# Altium project 电机驱动.PrjPCB
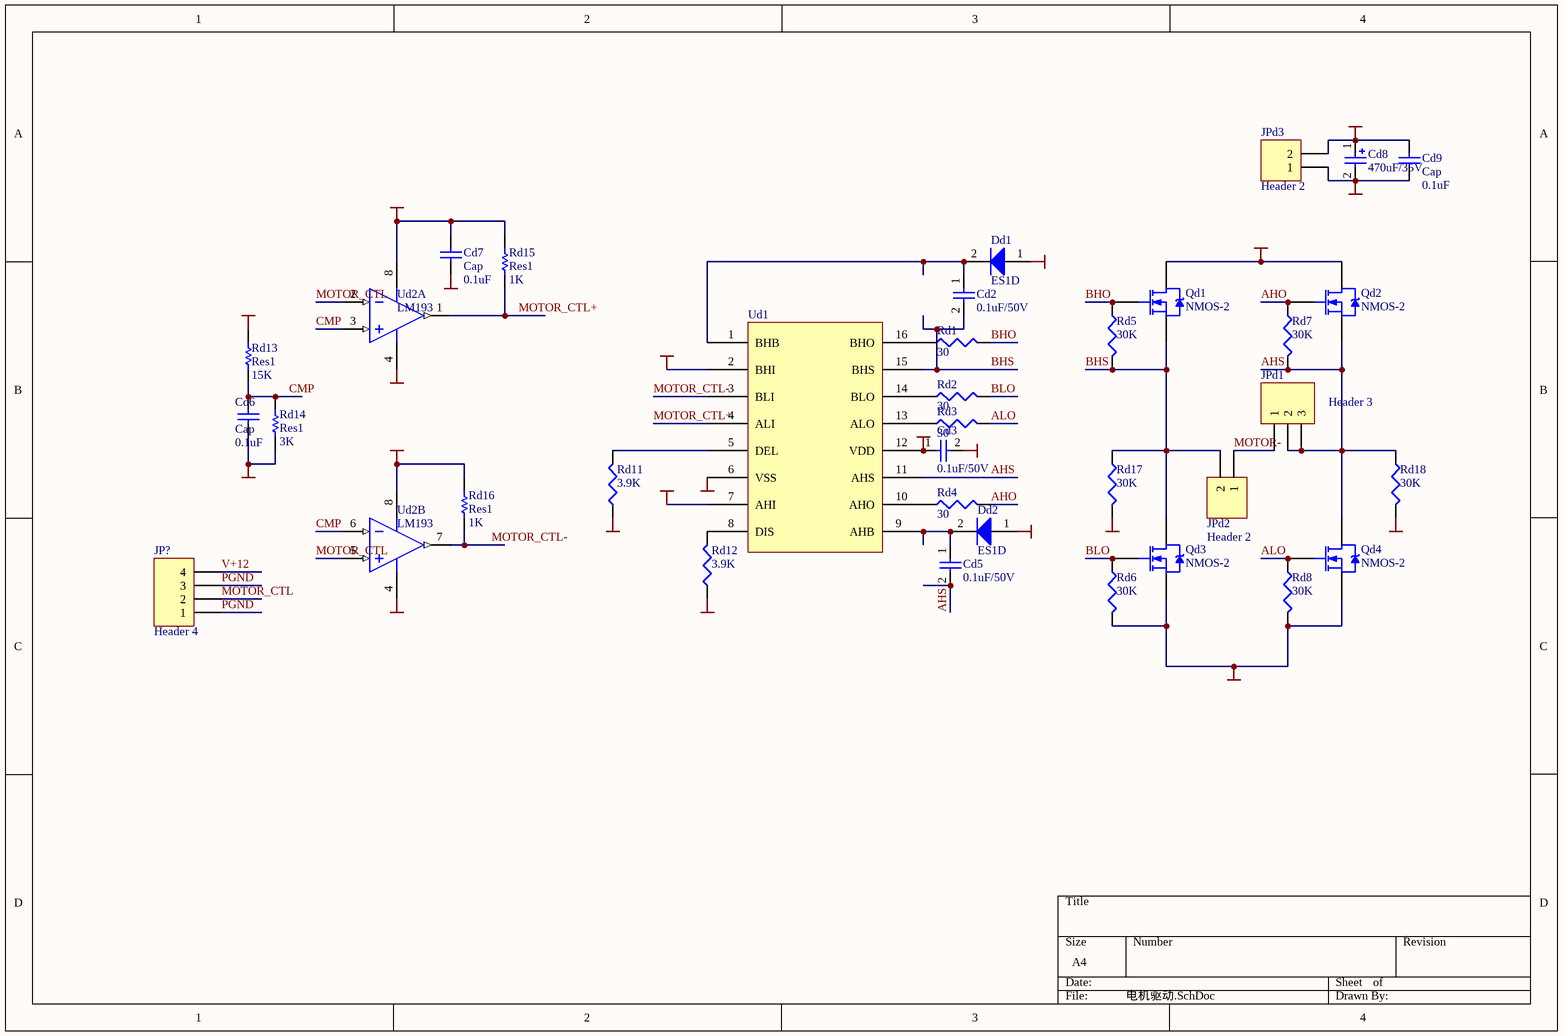
[diagram p0: 电机驱动.SchDoc]
1 sheet, 35 parts. Net scope: global (net labels, ports and power ports of the same name join across sheets).
Board file: 电机驱动.PcbDoc

## Sheet 电机驱动.SchDoc
size A4

### Parts
Cd2  value 0.1uF/50V  [CR2012-0805]  (hidden comment: Cap)
Cd3  value 0.1uF/50V  [CR2012-0805]  (hidden comment: Cap)
Cd5  value 0.1uF/50V  [CR2012-0805]  (hidden comment: Cap)
Cd6  Cap  value 0.1uF  [CR2012-0805]
Cd7  Cap  value 0.1uF  [CR2012-0805]
Cd8  value 470uF/35V  [C1000]  (hidden comment: Cap Pol1)
Cd9  Cap  value 0.1uF  [CR2012-0805]
Dd1  value ES1D  [DO-214-SMA-YX1]  (hidden comment: Diode_UFR)
Dd2  value ES1D  [DO-214-SMA-YX1]  (hidden comment: Diode_UFR)
JP1  Header 4  [HDR1X4]
JPd1  Header 3  [KG_3]
JPd2  Header 2  [CON_X2_B]
JPd3  Header 2  [CON_X2_B]
Qd1  NMOS-2  [252]
Qd2  NMOS-2  [252]
Qd3  NMOS-2  [252]
Qd4  NMOS-2  [252]
Rd1  value 30  [CR2012-0805]  (hidden comment: Res3)
Rd2  value 30  [CR2012-0805]  (hidden comment: Res3)
Rd3  value 30  [CR2012-0805]  (hidden comment: Res3)
Rd4  value 30  [CR2012-0805]  (hidden comment: Res3)
Rd5  value 30K  [CR2012-0805]  (hidden comment: Res3)
Rd6  value 30K  [CR2012-0805]  (hidden comment: Res3)
Rd7  value 30K  [CR2012-0805]  (hidden comment: Res3)
Rd8  value 30K  [CR2012-0805]  (hidden comment: Res3)
Rd11  value 3.9K  [CR2012-0805]  (hidden comment: Res3)
Rd12  value 3.9K  [CR2012-0805]  (hidden comment: Res3)
Rd13  Res1  value 15K  [CR2012-0805]
Rd14  Res1  value 3K  [CR2012-0805]
Rd15  Res1  value 1K  [CR2012-0805]
Rd16  Res1  value 1K  [CR2012-0805]
Rd17  value 30K  [CR3225-1210]  (hidden comment: Res3)
Rd18  value 30K  [CR3225-1210]  (hidden comment: Res3)
Ud1  HIP4082  [sop16]  (value not drawn)
Ud2  LM193  [SO-8]  (parts A,B of 2)

### Nets
DGND: Cd7.1 Ud1.6(VSS)
PGND: Cd3.2 Cd6.1 Cd8.2 Cd9.1 JP1.1 JP1.3 JPd3.1 Qd3.3(S) Qd4.3(S) Rd6.2 Rd8.2 Rd11.1 Rd12.1 Rd14.1 Rd17.2 Rd18.2 Ud2.4(GND)
V+12: Cd3.1 Cd7.2 Dd1.1(A) Dd2.1(A) JP1.4 Rd13.2 Rd15.2 Rd16.2 Ud1.2(BHI) Ud1.7(AHI) Ud1.12(VDD) Ud2.8(V+)
Vbat: Cd8.1 Cd9.2 JPd3.2 Qd1.2(D) Qd2.2(D)
AHO: Qd2.1(G) Rd4.2 Rd7.1
AHS: Cd5.2 JPd1.2 JPd1.3 Qd2.3(S) Qd4.2(D) Rd7.2 Rd18.1 Ud1.11(AHS)
ALO: Qd4.1(G) Rd3.2 Rd8.1
BHO: Qd1.1(G) Rd1.2 Rd5.1
BHS: Cd2.2 JPd2.2 Qd1.3(S) Qd3.2(D) Rd5.2 Rd17.1 Ud1.15(BHS)
BLO: Qd3.1(G) Rd2.2 Rd6.1
CMP: Cd6.2 Rd13.1 Rd14.2 Ud2.3(IN+) Ud2.6(IN-)
MOTOR-: JPd1.1 JPd2.1
MOTOR_CTL: JP1.2 Ud2.2(IN-) Ud2.5(IN+)
MOTOR_CTL+: Rd15.1 Ud1.4(ALI) Ud2.1(OUT)
MOTOR_CTL-: Rd16.1 Ud1.3(BLI) Ud2.7(OUT)
NetCd2_1: Cd2.1 Dd1.2(K) Ud1.1(BHB)
NetCd5_1: Cd5.1 Dd2.2(K) Ud1.9(AHB)
NetRd1_1: Rd1.1 Ud1.16(BHO)
NetRd2_1: Rd2.1 Ud1.14(BLO)
NetRd3_1: Rd3.1 Ud1.13(ALO)
NetRd4_1: Rd4.1 Ud1.10(AHO)
NetRd11_2: Rd11.2 Ud1.5(DEL)
NetRd12_2: Rd12.2 Ud1.8(DIS)

### Library data of the parts
Cd2 Cd3 Cd5 = Cap: Capacitor; Manufacturer: Generic Components; Class: Passive; Published: 08/06/2000; Publisher: Altium Hobart Technology Centre; SubClass: Capacitor
Cd6 Cd7 Cd9 = Cap: Capacitor; Published: 8-Jun-2000; LatestRevisionDate: 17-Jul-2002; LatestRevisionNote: Re-released for DXP Platform.; Publisher: Altium Limited
Cd8 = Cap Pol1: Polarized Capacitor (Radial); Manufacturer: Generic Components; Class: Passive; Published: 08/06/2000; Publisher: Altium Hobart Technology Centre; SubClass: Capacitor
Dd1 Dd2 = Diode_UFR: Ultra-Fast Rectifier Diode; Manufacturer: Generic Components; Class: Discrete; SubClass: Diode - Switching; Published: 08/06/2000; Publisher: Altium Hobart Technology Centre
JP1 = Header 4: Header, 4-Pin; Revision: 17-Jul-2002: Re-released for DXP Platform.; Publisher: Altium Limited
JPd1 = Header 3: Header, 3-Pin; Revision: 17-Jul-2002: Re-released for DXP Platform.; Publisher: Altium Limited
JPd2 JPd3 = Header 2: Header, 2-Pin; Revision: 17-Jul-2002: Re-released for DXP Platform.; Publisher: Altium Limited
Qd1-Qd4 = NMOS-2: N-Channel Power MOSFET; Note: Pin 2 is electrically connected to pin 4.; Published: 8-Jun-2000; LatestRevisionDate: 17-Jul-2002; LatestRevisionNote: Re-released for DXP Platform.; DatasheetDocument: PD-9.814; PackageReference: TO-220AB; Publisher: Altium Limited; Code_JEDEC: TO-220-AB
Rd1-Rd8 Rd11 Rd12 Rd17 Rd18 = Res3: Resistor; Published: 8-Jun-2000; Revision: July-2002: Re-released for DXP Platform.; Publisher: Altium Limited
Rd13-Rd16 = Res1: Resistor; Published: 8-Jun-2000; LatestRevisionDate: 17-Jul-2002; LatestRevisionNote: Re-released for DXP Platform.; Publisher: Altium Limited
Ud2 = TLC3702ID: Dual Micropower LinCMOS Voltage Comparator; Package Information: Latest Revision: Jan-1998; Published: 23-Sep-2002; Datasheet: Latest Revision: Nov-1998; Package Reference: D008; Publisher: Altium Limited